# EAGLE design G-CLEF Shutter Testing (EAGLE 9.1.0)
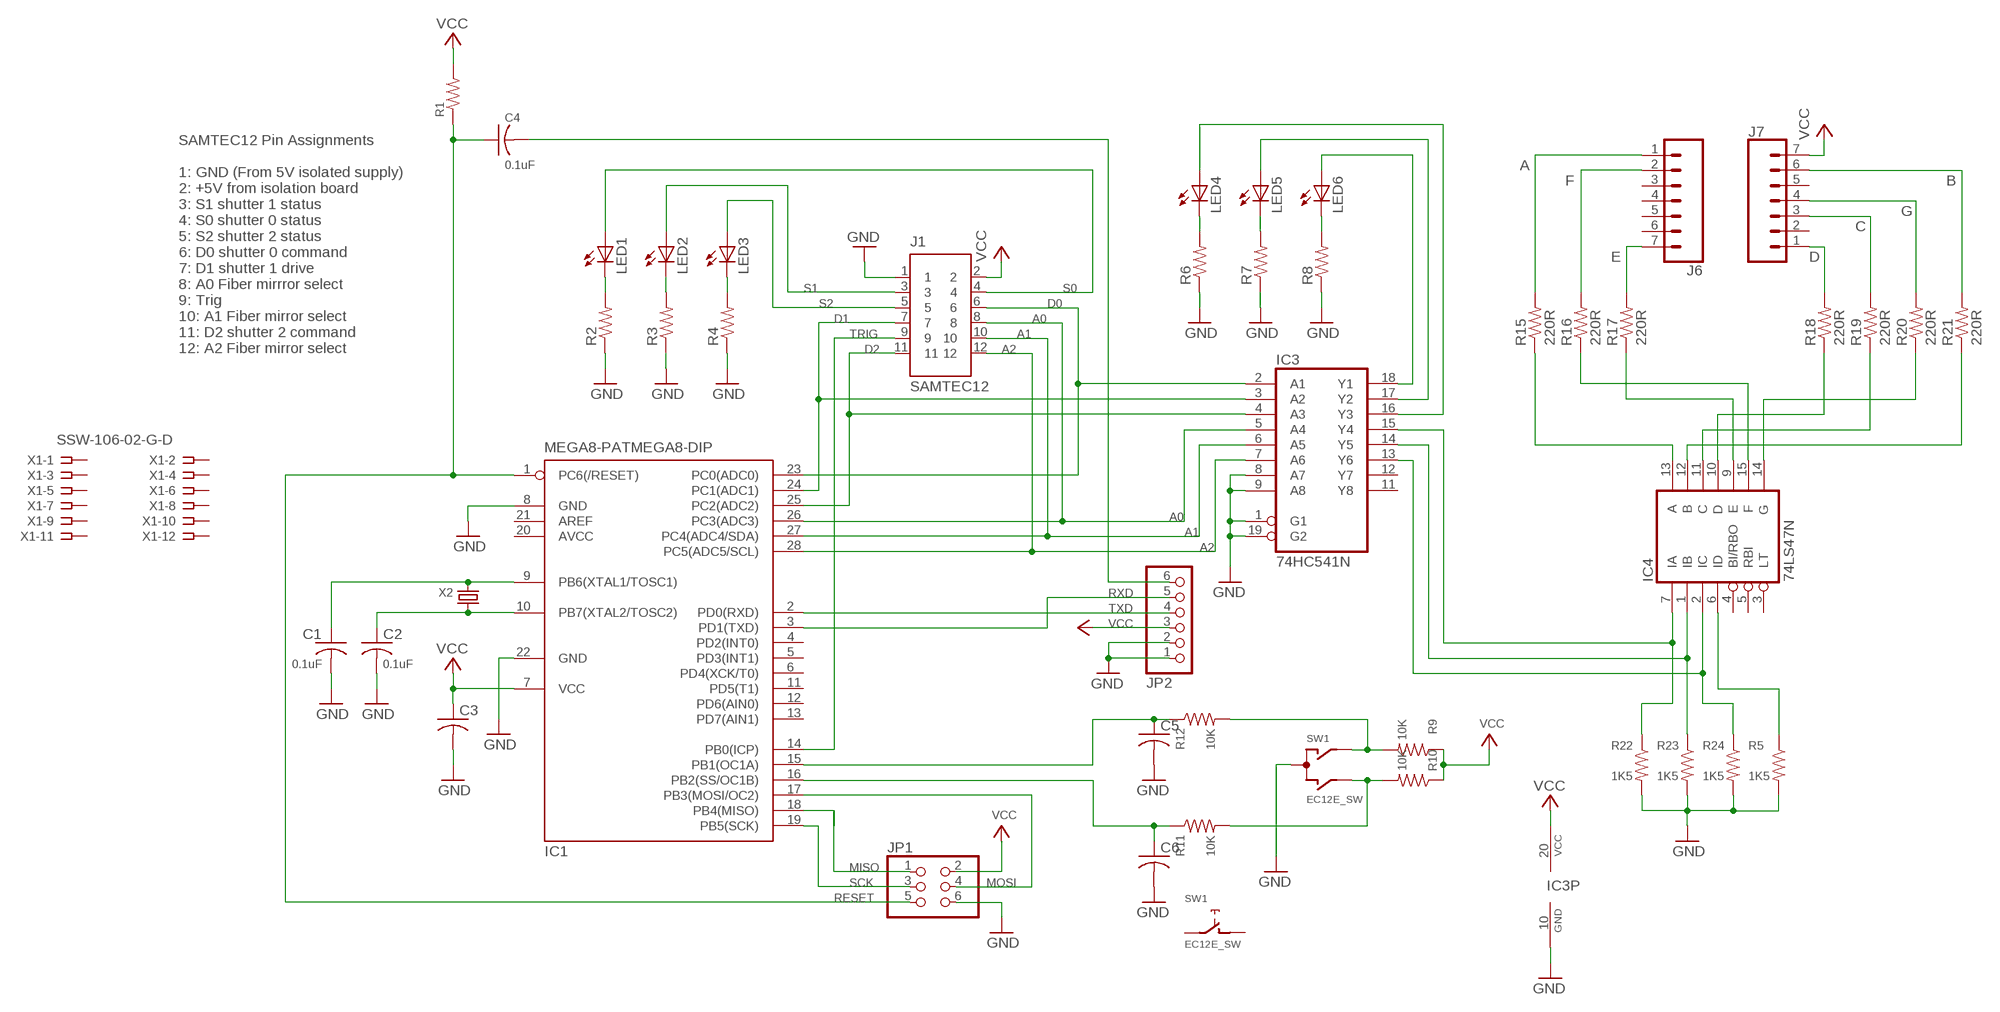
[diagram p0: schematic, sheet 1, part 1 of 2]
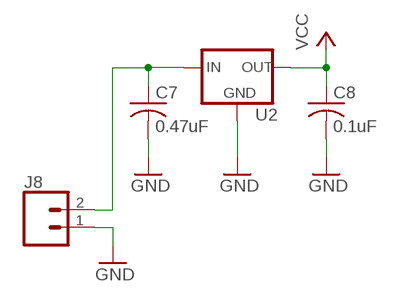
[diagram p1: schematic, sheet 1, part 2 of 2]

## Parts
C1  0.1uF  C-US025-024X044  [C025-024X044]
C2  0.1uF  C-US025-024X044  [C025-024X044]
C3  C-US025-024X044  [C025-024X044]
C4  0.1uF  C-US025-024X044  [C025-024X044]
C5  C-US025-024X044  [C025-024X044]
C6  C-US025-024X044  [C025-024X044]
C7  0.47uF  C-US050-025X075  [C050-025X075]
C8  0.1uF  C-US050-025X075  [C050-025X075]
IC1  MEGA8-PATMEGA8-DIP  [DIP762W53P254L3467H457Q28B]
IC3  74HC541N  74LS541N  [DIL20]
IC4  74LS47N  [DIL16]
J1  SAMTEC12  [SAMTEC12]
J6  CONN_07  [1X07]
J7  CONN_07  [1X07]
J8  CONN_02  [1X02]
JP1  PINHD-2X3  [2X03]
JP2  PINHD-1X6/90  [1X06/90]
LED1  LED5MM  [LED5MM]
LED2  LED5MM  [LED5MM]
LED3  LED5MM  [LED5MM]
LED4  LED5MM  [LED5MM]
LED5  LED5MM  [LED5MM]
LED6  LED5MM  [LED5MM]
R1  R-US_0207/7  [0207/7]
R2  R-US_0207/7  [0207/7]
R3  R-US_0207/7  [0207/7]
R4  R-US_0207/7  [0207/7]
R5  1K5  R-US_0207/7  [0207/7]
R6  R-US_0207/7  [0207/7]
R7  R-US_0207/7  [0207/7]
R8  R-US_0207/7  [0207/7]
R9  10K  R-US_0207/7  [0207/7]
R10  10K  R-US_0207/7  [0207/7]
R11  10K  R-US_0207/7  [0207/7]
R12  10K  R-US_0207/7  [0207/7]
R15  220R  R-US_0207/7  [0207/7]
R16  220R  R-US_0207/7  [0207/7]
R17  220R  R-US_0207/7  [0207/7]
R18  220R  R-US_0207/7  [0207/7]
R19  220R  R-US_0207/7  [0207/7]
R20  220R  R-US_0207/7  [0207/7]
R21  220R  R-US_0207/7  [0207/7]
R22  1K5  R-US_0207/7  [0207/7]
R23  1K5  R-US_0207/7  [0207/7]
R24  1K5  R-US_0207/7  [0207/7]
SW1  EC12E_SW  [ALPS_EC12E_SW]
U2  V_REG_78XXSINK  [TO220-IGO]
X1  SSW-106-02-G-D  [SSW-106-02-G-D]
X2  CRYSTALS-NOGND-HC49  [HC49]

## Nets
A: J6.1 R15.2
A0: IC1.26(PC3(ADC3)) IC3.5(A4) J1.8
A1: IC1.27(PC4(ADC4/SDA)) IC3.6(A5) J1.10
A2: IC1.28(PC5(ADC5/SCL)) IC3.7(A6) J1.12
B: J7.6 R21.2
C: J7.3 R19.2
D: J7.1 R18.2
D0: IC1.23(PC0(ADC0)) IC3.2(A1) J1.6
D1: IC1.24(PC1(ADC1)) IC3.3(A2) J1.7
D2: IC1.25(PC2(ADC2)) IC3.4(A3) J1.11
E: J6.7 R17.2
F: J6.2 R16.2
G: J7.4 R20.2
GND: C1.2 C2.2 C3.2 C5.2 C6.2 C7.2 C8.2 IC1.8(GND) IC1.22(GND) IC3.1(G1) IC3.8(A7) IC3.9(A8) IC3.10(GND) IC3.19(G2) J1.1 J8.1 JP1.6 JP2.1 JP2.2 R2.1 R3.1 R4.1 R5.2 R6.1 R7.1 R8.1 R22.2 R23.2 R24.2 SW1.C U2.GND
MISO: IC1.18(PB4(MISO)) JP1.1
MOSI: IC1.17(PB3(MOSI/OC2)) JP1.4
N$1: C1.1 IC1.9(PB6(XTAL1/TOSC1)) X2.2
N$2: C2.1 IC1.10(PB7(XTAL2/TOSC2)) X2.1
N$3: C4.2 JP2.6
N$4: IC4.6(ID) R5.1
N$5: LED4.K(C) R6.2
N$6: LED5.K(C) R7.2
N$7: LED6.K(C) R8.2
N$8: IC3.18(Y1) LED6.A
N$9: IC3.17(Y2) LED5.A
N$10: IC3.16(Y3) LED4.A
N$11: C5.1 IC1.15(PB1(OC1A)) R12.1
N$12: R9.2 R12.2 SW1.A
N$13: R10.2 R11.2 SW1.B
N$14: C6.1 IC1.16(PB2(SS/OC1B)) R11.1
N$15: LED1.K(C) R2.2
N$16: LED2.K(C) R3.2
N$17: LED3.K(C) R4.2
N$29: IC4.13(A) R15.1
N$30: IC4.12(B) R21.1
N$31: IC4.11(C) R19.1
N$32: IC4.10(D) R18.1
N$33: IC4.9(E) R17.1
N$34: IC4.15(F) R16.1
N$35: IC4.14(G) R20.1
N$36: C7.1 J8.2 U2.IN
N$37: IC3.13(Y6) IC4.2(IC) R24.1
N$38: IC3.14(Y5) IC4.1(IB) R23.1
N$39: IC3.15(Y4) IC4.7(IA) R22.1
RESET: C4.1 IC1.1(PC6(/RESET)) JP1.5 R1.1
RXD: IC1.3(PD1(TXD)) JP2.5
S0: J1.4 LED1.A
S1: J1.3 LED2.A
S2: J1.5 LED3.A
SCK: IC1.19(PB5(SCK)) JP1.3
TRIG: IC1.14(PB0(ICP)) J1.9
TXD: IC1.2(PD0(RXD)) JP2.4
VCC: C3.1 C8.1 IC1.7(VCC) IC3.20(VCC) J1.2 J7.7 JP1.2 JP2.3 R1.2 R9.1 R10.1 U2.OUT
Unconnected: IC1.4(PD2(INT0)) IC1.5(PD3(INT1)) IC1.6(PD4(XCK/T0)) IC1.11(PD5(T1)) IC1.12(PD6(AIN0)) IC1.13(PD7(AIN1)) IC1.21(AREF) IC3.11(Y8) IC3.12(Y7) IC4.3(LT) IC4.4(BI/RBO) IC4.5(RBI) J6.3 J6.4 J6.5 J6.6 J7.2 J7.5 SW1.D SW1.E SW1.GND1(G) SW1.GND2(G) X1.1 X1.2 X1.3 X1.4 X1.5 X1.6 X1.7 X1.8 X1.9 X1.10 X1.11 X1.12

## Notes on the sheet
- SAMTEC12 Pin Assignments
  
  1: GND (From 5V isolated supply)
  2: +5V from isolation board
  3: S1 shutter 1 status
  4: S0 shutter 0 status
  5: S2 shutter 2 status
  6: D0 shutter 0 command
  7: D1 shutter 1 drive
  8: A0 Fiber mirrror select
  9: Trig
  10: A1 Fiber mirror select
  11: D2 shutter 2 command
  12: A2 Fiber mirror select

## Power pins joined to a net without a drawn wire
AVCC: IC1.20(AVCC)
GND: IC4.8(GND)
VCC: IC4.16(VCC)

## Library data of the parts
C1-C6 = AUmlib:C-US: CAPACITOR, American symbol; SPICEPREFIX: C
C7 C8 = rcl:C-US: CAPACITOR, American symbol; SPICEPREFIX: C
IC1 = AUmlib:MEGA8-P: MICROCONTROLLER 8 Kbytes FLASH, 1 kbytes SRAM, 512 bytes EEPROM, USART, 4-channel 10 bit ADC, 2-channel 8 bit ADC Pin compatible with Atmega48, ATMega88, ATMega168 Source: avr.lbr
IC3 = AUmlib:74*541: Octal BUFFER and LINE DRIVER, 3-state
IC4 = 74xx-us:74*47: BCD to seven segment DECODER/DRIVER Source: http://www.ee.washington.edu/stores/DataSheets/74ls/74ls47.pdf
J1 = AU:SAMTEC12
J6 J7 = SparkFun-Connectors:CONN_07: Multi connection point. Often used as Generic Header-pin footprint for 0.1 inch spaced/style header connections On any of the 0.1 inch spaced packages, you can populate with these: Break Away Headers - Straight <https://www.sparkfun.com/products/116> (PRT-00116) Break Away Male Headers - Right Angle <https://www.sparkfun.com/products/553> (PRT-00553) Female Headers <https://www.sparkfun.com/products/115> (PRT-00115) Break Away Headers - Machine Pin <https://www.sparkfun.com/products/117> (PRT-00117) Break Away Female Headers - Swiss Machine Pin <https://www.sparkfun.com/products/743> (PRT-00743) For SCREWTERMINALS and SPRING TERMINALS visit here: Screw Terimnals on SparkFun.com <https://www.sparkfun.com/search/results?term=Screw+Terminals> (5mm/3.5mm/2.54mm spacing) This device is also useful as a general connection point to wire up your design to another part of your project. Our various solder wires solder well into these plated through hole pads. Hook-Up Wire - Assortment (Stranded, 22 AWG) <https://www.sparkfun.com/products/11375> (PRT-11375) Hook-Up Wire - Assortment (Solid Core, 22 AWG) <https://www.sparkfun.com/products/11367> (PRT-11367) View the entire wire category on our website here <https://www.sparkfun.com/categories/141> Special notes: Molex polarized connector foot print use with SKU : PRT-08231 with associated crimp pins and housings. 1MM SMD Version SKU: PRT-10208 NOTES ON THE VARIANTS LOCK and LOCK_LONGPADS... This footprint was designed to help hold the alignment of a through-hole component (i.e. 6-pin header) while soldering it into place. You may notice that each hole has been shifted either up or down by 0.005 of an inch from it's more standard position (which is a perfectly straight line). This slight alteration caused the pins (the squares in the middle) to touch the edges of the holes. Because they are alternating, it causes a "brace" to hold the component in place. 0.005 has proven to be the perfect amount of "off-center" position when using our standard breakaway headers. Although looks a little odd when you look at the bare footprint, once you have a header in there, the alteration is very hard to notice. Also,if you push a header all the way into place, it is covered up entirely on the bottom side.
J8 = SparkFun-Connectors:CONN_02: Multi connection point. Often used as Generic Header-pin footprint for 0.1 inch spaced/style header connections On any of the 0.1 inch spaced packages, you can populate with these: Break Away Headers - Straight <https://www.sparkfun.com/products/116> (PRT-00116) Break Away Male Headers - Right Angle <https://www.sparkfun.com/products/553> (PRT-00553) Female Headers <https://www.sparkfun.com/products/115> (PRT-00115) Break Away Headers - Machine Pin <https://www.sparkfun.com/products/117> (PRT-00117) Break Away Female Headers - Swiss Machine Pin <https://www.sparkfun.com/products/743> (PRT-00743) For SCREWTERMINALS and SPRING TERMINALS visit here: Screw Terimnals on SparkFun.com <https://www.sparkfun.com/search/results?term=Screw+Terminals> (5mm/3.5mm/2.54mm spacing) This device is also useful as a general connection point to wire up your design to another part of your project. Our various solder wires solder well into these plated through hole pads. Hook-Up Wire - Assortment (Stranded, 22 AWG) <https://www.sparkfun.com/products/11375> (PRT-11375) Hook-Up Wire - Assortment (Solid Core, 22 AWG) <https://www.sparkfun.com/products/11367> (PRT-11367) View the entire wire category on our website here <https://www.sparkfun.com/categories/141> Special notes: Molex polarized connector foot print use with: PRT-08233 with associated crimp pins and housings. 2.54_SCREWTERM for use with PRT-10571. 3.5mm Screw Terminal footprints for PRT-08084 5mm Screw Terminal footprints for use with PRT-08432
JP1 = AUmlib:PINHD-2X3: PIN HEADER
JP2 = AUmlib:PINHD-1X6: PIN HEADER
LED1-LED6 = AUmlib:LED: LED OSRAM: - CHIPLED LG R971, LG N971, LY N971, LG Q971, LY Q971, LO R971, LY R971 LH N974, LH R974 LS Q976, LO Q976, LY Q976 LO Q996 - Hyper CHIPLED LW Q18S LB Q993, LB Q99A, LB R99A - SideLED LS A670, LO A670, LY A670, LG A670, LP A670 LB A673, LV A673, LT A673, LW A673 LH A674 LY A675 LS A676, LA A676, LO A676, LY A676, LW A676 LS A679, LY A679, LG A679 - Hyper Micro SIDELED® LS Y876, LA Y876, LO Y876, LY Y876 LT Y87S - SmartLED LW L88C, LW L88S LB L89C, LB L89S, LG L890 LS L89K, LO L89K, LY L89K LS L896, LA L896, LO L896, LY L896 - TOPLED LS T670, LO T670, LY T670, LG T670, LP T670 LSG T670, LSP T670, LSY T670, LOP T670, LYG T670 LG T671, LOG T671, LSG T671 LB T673, LV T673, LT T673, LW T673 LH T674 LS T676, LA T676, LO T676, LY T676, LB T676, LH T676, LSB T676, LW T676 LB T67C, LV T67C, LT T67C, LS T67K, LO T67K, LY T67K, LW E67C LS E67B, LA E67B, LO E67B, LY E67B, LB E67C, LV E67C, LT E67C LW T67C LS T679, LY T679, LG T679 LS T770, LO T770, LY T770, LG T770, LP T770 LB T773, LV T773, LT T773, LW T773 LH T774 LS E675, LA E675, LY E675, LS T675 LS T776, LA T776, LO T776, LY T776, LB T776 LHGB T686 LT T68C, LB T68C - Hyper Mini TOPLED® LB M676 - Mini TOPLED Santana® LG M470 LS M47K, LO M47K, LY M47K Source: http://www.osram.convergy.de LUXEON: - LUMILED® LXK2-PW12-R00, LXK2-PW12-S00, LXK2-PW14-U00, LXK2-PW14-V00 LXK2-PM12-R00, LXK2-PM12-S00, LXK2-PM14-U00 LXK2-PE12-Q00, LXK2-PE12-R00, LXK2-PE12-S00, LXK2-PE14-T00, LXK2-PE14-U00 LXK2-PB12-K00, LXK2-PB12-L00, LXK2-PB12-M00, LXK2-PB14-N00, LXK2-PB14-P00, LXK2-PB14-Q00 LXK2-PR12-L00, LXK2-PR12-M00, LXK2-PR14-Q00, LXK2-PR14-R00 LXK2-PD12-Q00, LXK2-PD12-R00, LXK2-PD12-S00 LXK2-PH12-R00, LXK2-PH12-S00 LXK2-PL12-P00, LXK2-PL12-Q00, LXK2-PL12-R00 Source: www.luxeon.com KINGBRIGHT: KA-3528ASYC Source: www.kingbright.com
R1-R4 R6-R8 = AUmlib:R-US_: RESISTOR, American symbol; SPICEPREFIX: R
R5 R9-R12 R15-R24 = rcl:R-US_: RESISTOR, American symbol; SPICEPREFIX: R
SW1 = AUmlib:EC12E_SW: ALPS rotary Encoder EC12E series with switch; MPN: EC12E2424407; OC_FARNELL: 1520813; OC_NEWARK: 74M1068
U2 = SparkFun-IC-Power:V_REG_78XX: Voltage Regulator Standard 78xx regulator. IGO (Input Ground Output). Spark Fun Electronics SKU : COM-00107
X1 = con-samtec:SSW-106-02-G: THROUGH-HOLE .025" SQ POST SOCKET Source: Samtec SSW.pdf; MF: Samtec Inc.; MPN: SSW-106-02-G-D; OC_FARNELL: unknown; OC_NEWARK: 11P9414
X2 = AUmlib:CRYSTALS-NOGND: CRYSTALS CAN NOT GROUNDED

## Board
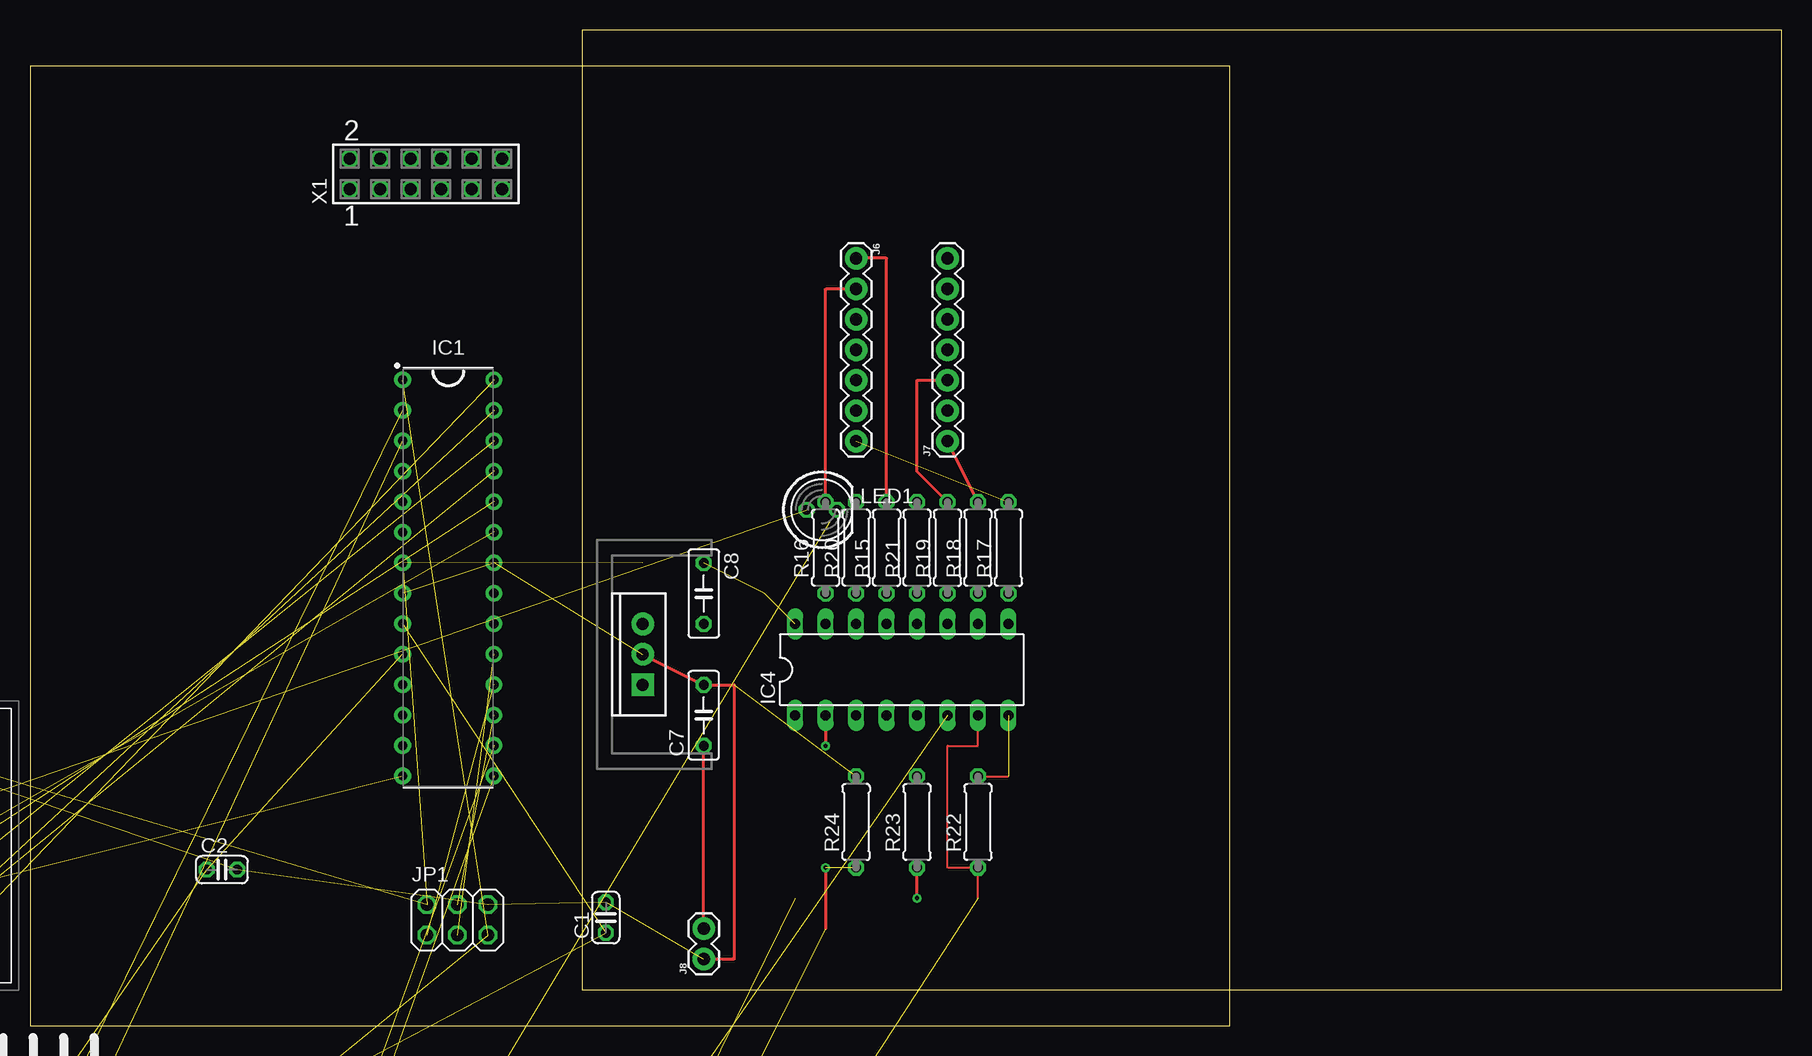
[diagram p2: board, top side]
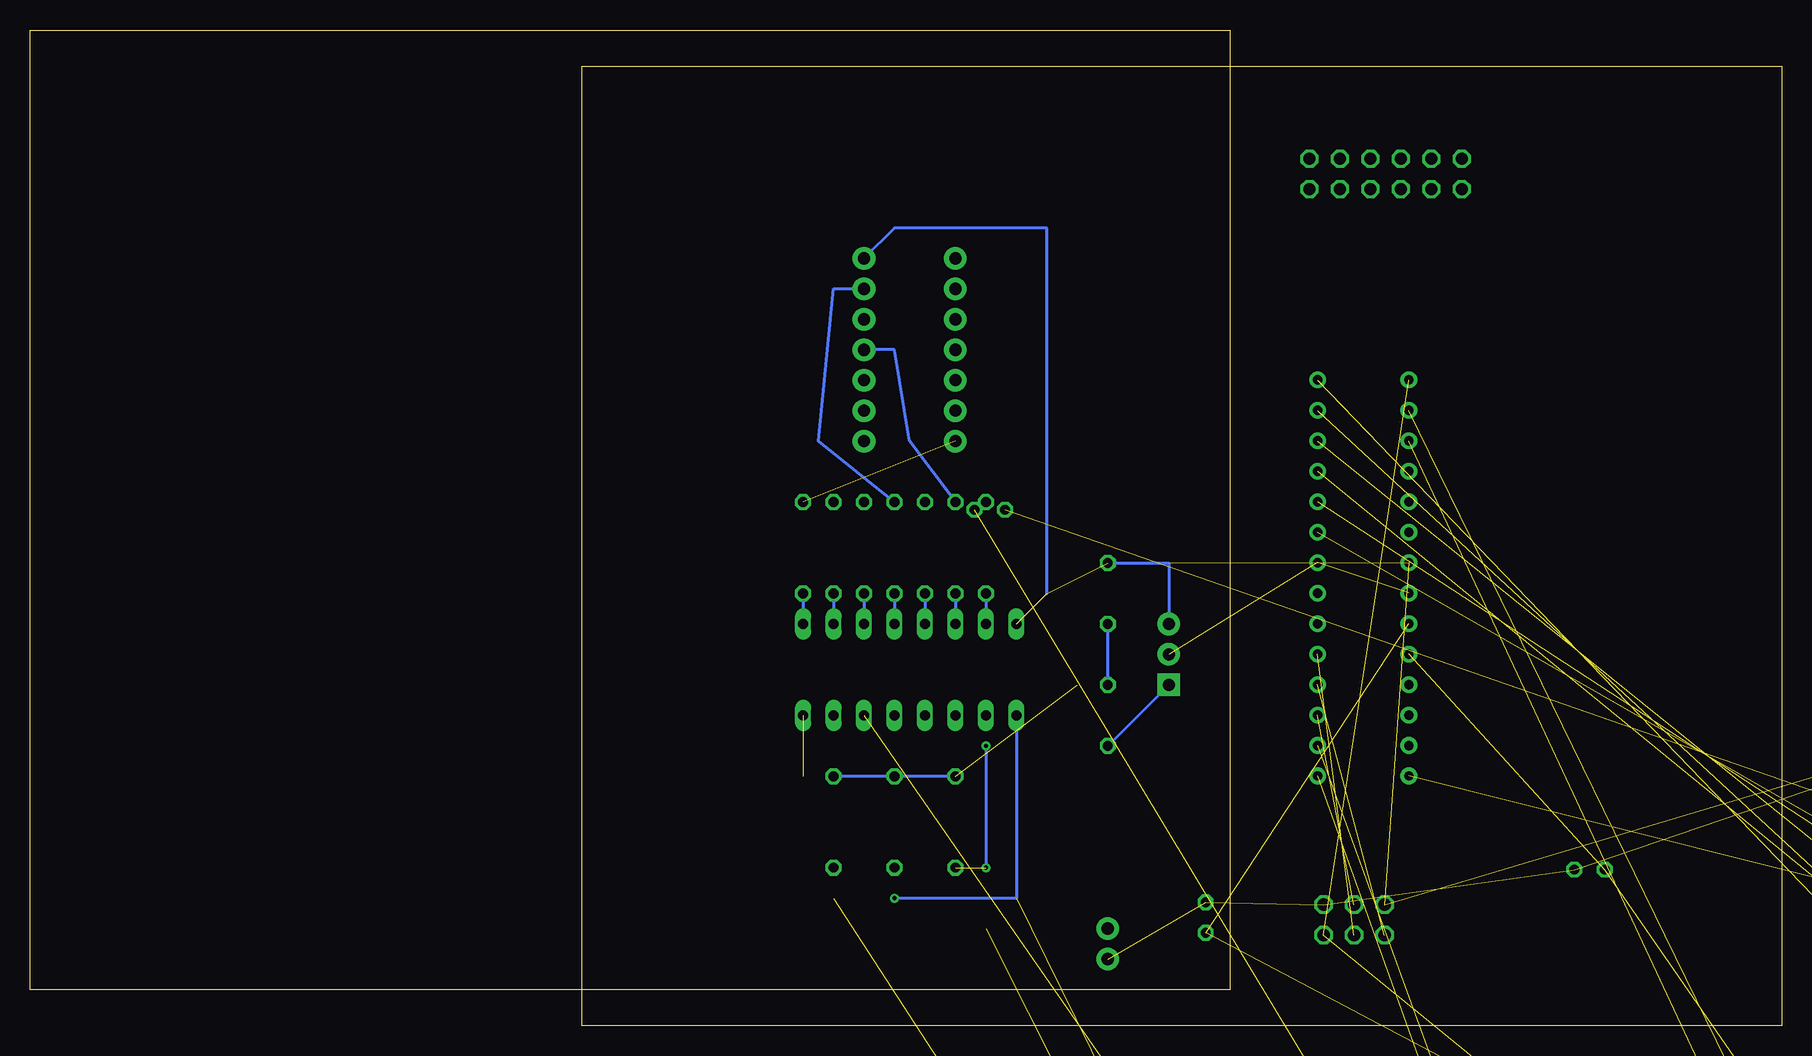
[diagram p3: board, bottom side, seen from below]

Size 146 x 83 mm. Coordinates in mm from the lower left corner, seen from the top.
Outline: 0,0 100,0 100,80 0,80 0,0
Outline: 46,3 146,3 146,83 46,83 46,3
Copper layers (1*16): Top 0.035mm / dielectric 1.5mm / Bottom 0.035mm
Design rules "default": minimum track width 6mil, minimum drill 0.35mm, track to track 6mil, track to pad 6mil, pad to pad 6mil, via to via 6mil, smd to smd 6mil, copper to edge 40mil, drill to drill 6mil, minimum pad ring 10mil, minimum via ring 8mil, stop-mask expansion 4mil, vias tented up to drill 0mil, thermal gap 10mil

### Footprints (pad centres in the part's own frame; a part is rotated, then mirrored left to right if it is on the bottom)
C025-024X044 = drill 0.813 octagon: 1 -1.27,0; 2 1.27,0
C050-025X075 = drill 0.813 octagon: 1 -2.54,0; 2 2.54,0
DIP762W53P254L3467H457Q28B = drill 0.786 pad 1.386: 1 -3.81,16.51; 2 -3.81,13.97; 3 -3.81,11.43; 4 -3.81,8.89; 5 -3.81,6.35; 6 -3.81,3.81; 7 -3.81,1.27; 8 -3.81,-1.27; 9 -3.81,-3.81; 10 -3.81,-6.35; 11 -3.81,-8.89; 12 -3.81,-11.43; 13 -3.81,-13.97; 14 -3.81,-16.51; 15 3.81,-16.51; 16 3.81,-13.97; 17 3.81,-11.43; 18 3.81,-8.89; 19 3.81,-6.35; 20 3.81,-3.81; 21 3.81,-1.27; 22 3.81,1.27; 23 3.81,3.81; 24 3.81,6.35; 25 3.81,8.89; 26 3.81,11.43; 27 3.81,13.97; 28 3.81,16.51
DIL20 = drill 0.813 long: 1 -11.43,-3.81; 2 -8.89,-3.81; 3 -6.35,-3.81; 4 -3.81,-3.81; 5 -1.27,-3.81; 6 1.27,-3.81; 7 3.81,-3.81; 8 6.35,-3.81; 9 8.89,-3.81; 10 11.43,-3.81; 11 11.43,3.81; 12 8.89,3.81; 13 6.35,3.81; 14 3.81,3.81; 15 1.27,3.81; 16 -1.27,3.81; 17 -3.81,3.81; 18 -6.35,3.81; 19 -8.89,3.81; 20 -11.43,3.81
DIL16 = drill 0.813 long: 1 -8.89,-3.81; 2 -6.35,-3.81; 3 -3.81,-3.81; 4 -1.27,-3.81; 5 1.27,-3.81; 6 3.81,-3.81; 7 6.35,-3.81; 8 8.89,-3.81; 9 8.89,3.81; 10 6.35,3.81; 11 3.81,3.81; 12 1.27,3.81; 13 -1.27,3.81; 14 -3.81,3.81; 15 -6.35,3.81; 16 -8.89,3.81
SAMTEC12 = drill 0.6 square: 1 -1.27,6.35 | drill 0.6: 2 1.27,6.35; 3 -1.27,3.81; 4 1.27,3.81; 5 -1.27,1.27; 6 1.27,1.27; 7 -1.27,-1.27; 8 1.27,-1.27; 9 -1.27,-3.81; 10 1.27,-3.81; 11 -1.27,-6.35; 12 1.27,-6.35
1X07 = drill 1.016 pad 1.88: 1 0,0; 2 2.54,0; 3 5.08,0; 4 7.62,0; 5 10.16,0; 6 12.7,0; 7 15.24,0
1X02 = drill 1.016 pad 1.88: 1 0,0; 2 2.54,0
2X03 = drill 1.016 octagon: 1 -2.54,-1.27; 2 -2.54,1.27; 3 0,-1.27; 4 0,1.27; 5 2.54,-1.27; 6 2.54,1.27
1X06/90 = drill 1.016 long: 1 -6.35,-3.81; 2 -3.81,-3.81; 3 -1.27,-3.81; 4 1.27,-3.81; 5 3.81,-3.81; 6 6.35,-3.81
LED5MM = drill 0.813 octagon: A -1.27,0; K 1.27,0
0207/7 = drill 0.813 octagon: 1 -3.81,0; 2 3.81,0
ALPS_EC12E_SW = drill 1 square: A -2.5,-7.5; B 2.5,-7.5; C 0,-7.5; D -2.5,7; E 2.5,7 | drill 2.2 square: GND1 -6.1,0; GND2 6.1,0
TO220-IGO = drill 1 pad 1.88: GND 0,0; OUT 2.54,0 | drill 1 pad 1.88 square: IN -2.54,0
SSW-106-02-G-D = drill 1 pad 1.5 octagon: 1 -6.35,-1.27; 2 -6.35,1.27; 3 -3.81,-1.27; 4 -3.81,1.27; 5 -1.27,-1.27; 6 -1.27,1.27; 7 1.27,-1.27; 8 1.27,1.27; 9 3.81,-1.27; 10 3.81,1.27; 11 6.35,-1.27; 12 6.35,1.27
HC49 = drill 0.813 pad 1.8: 1 -2.413,0; 2 2.413,0

### Placement (x,y rotation side)
C1  48,9 90 top
C2  16,13 0 top
C3  -9,-27 0 top  (outside the outline)
C4  -9,-32 0 top  (outside the outline)
C5  -25,-167 0 top  (outside the outline)
C6  -25,-172 0 top  (outside the outline)
C7  56.16,25.86 90 top
C8  56.16,36.02 270 top
IC1  34.87,37.32 0 top
IC3  4,-107 0 top  (outside the outline)
IC4  72.67,29.67 0 top
J1  -6,15 0 top  (outside the outline)
J6  68.86,63.96 270 top
J7  76.48,48.72 90 top
J8  56.16,5.54 90 top
JP1  35.63,8.81 0 top
JP2  -1,-8 0 top  (outside the outline)
LED1  66,43 0 top
LED2  -8,-60 0 top  (outside the outline)
LED3  -8,-67 0 top  (outside the outline)
LED4  -8,-116 0 top  (outside the outline)
LED5  -8,-123 0 top  (outside the outline)
LED6  -8,-130 0 top  (outside the outline)
R1  -7,-37 0 top  (outside the outline)
R2  -7,-74 0 top  (outside the outline)
R3  -7,-79 0 top  (outside the outline)
R4  -7,-84 0 top  (outside the outline)
R5  -7,-100 0 top  (outside the outline)
R6  -7,-137 0 top  (outside the outline)
R7  3,-137 0 top  (outside the outline)
R8  -7,-142 0 top  (outside the outline)
R9  -23,-147 0 top  (outside the outline)
R10  -23,-152 0 top  (outside the outline)
R11  -23,-157 0 top  (outside the outline)
R12  -23,-162 0 top  (outside the outline)
R15  71.4,39.83 90 top
R16  66.32,39.83 90 top
R17  81.56,39.83 90 top
R18  79.02,39.83 90 top
R19  76.48,39.83 90 top
R20  68.86,39.83 90 top
R21  73.94,39.83 90 top
R22  79.02,16.97 90 top
R23  73.94,16.97 90 top
R24  68.86,16.97 90 top
SW1  -20,-132 0 top  (outside the outline)
U2  51.08,30.94 90 top
X1  33,71 0 top
X2  -5,-19 0 top  (outside the outline)

### Tracks (layer width: path | path; a pad name or v marks a point on that pad's centre or on a via)
A
  Top 0.254: R15.2 71.4,63.96 J6.1
A0  (2 unrouted)
A1  (2 unrouted)
A2  (2 unrouted)
B
  Bottom 0.254: R21.2 80.29,48.72 79.02,61.42 J7.6
C
  Top 0.254: R19.2 73.94,46.18 73.94,53.8 J7.3
D
  Top 0.254: R18.2 J7.1
D0  (2 unrouted)
D1  (2 unrouted)
D2  (2 unrouted)
E  (1 unrouted)
F
  Top 0.254: J6.2 66.32,61.42 R16.2
G
  Bottom 0.254: R20.2 72.67,48.72 73.94,56.34 J7.4
GND  (via drill 0.35)  (26 unrouted)
  Top 0.152: R22.2 81.56,20.78
  Top 0.254: U2.GND C7.2 58.7,28.4 58.7,5.54 J8.1
  Bottom 0.254: C7.2 C8.2 | R24.2 R23.2 R22.2
  other vias: 68.86,20.78
MISO  (1 unrouted)
MOSI  (1 unrouted)
N$1  (2 unrouted)
N$2  (2 unrouted)
N$3  (1 unrouted)
N$4  (1 unrouted)
N$5  (1 unrouted)
N$6  (1 unrouted)
N$7  (1 unrouted)
N$8  (1 unrouted)
N$9  (1 unrouted)
N$10  (1 unrouted)
N$11  (2 unrouted)
N$12  (2 unrouted)
N$13  (2 unrouted)
N$14  (2 unrouted)
N$15  (1 unrouted)
N$16  (1 unrouted)
N$17  (1 unrouted)
N$29
  Bottom 0.254: R15.1 IC4.13
N$30
  Bottom 0.254: R21.1 IC4.12
N$31
  Bottom 0.254: R19.1 IC4.11
N$32
  Bottom 0.254: R18.1 IC4.10
N$33
  Bottom 0.254: R17.1 IC4.9
N$34
  Bottom 0.254: R16.1 IC4.15
N$35
  Bottom 0.254: R20.1 IC4.14
N$36
  Top 0.254: J8.2 C7.1
  Bottom 0.254: C7.1 U2.IN
N$37  (via drill 0.35)  (2 unrouted)
  Top 0.254: IC4.2 v66.32,23.32 | v66.32,13.16 66.32,8.08
  Bottom 0.254: v66.32,23.32 v66.32,13.16
N$38  (via drill 0.35)  (1 unrouted)
  Top 0.254: v73.94,10.62 R23.1
  Bottom 0.254: IC4.1 63.78,10.62 v73.94,10.62
N$39  (1 unrouted)
  Top 0.152: 79.02,10.62 R22.1 76.48,13.16 76.48,23.32 79.02,23.32 IC4.7
RESET  (3 unrouted)
RXD  (1 unrouted)
S0  (1 unrouted)
S1  (1 unrouted)
S2  (1 unrouted)
SCK  (1 unrouted)
TRIG  (1 unrouted)
TXD  (1 unrouted)
VCC  (11 unrouted)
  Bottom 0.254: C8.1 51.08,38.56 U2.OUT | 61.24,36.02 61.24,66.5 73.94,66.5 J7.7